# EAGLE board micromouse (EAGLE 9.6.2), part 1 of 2
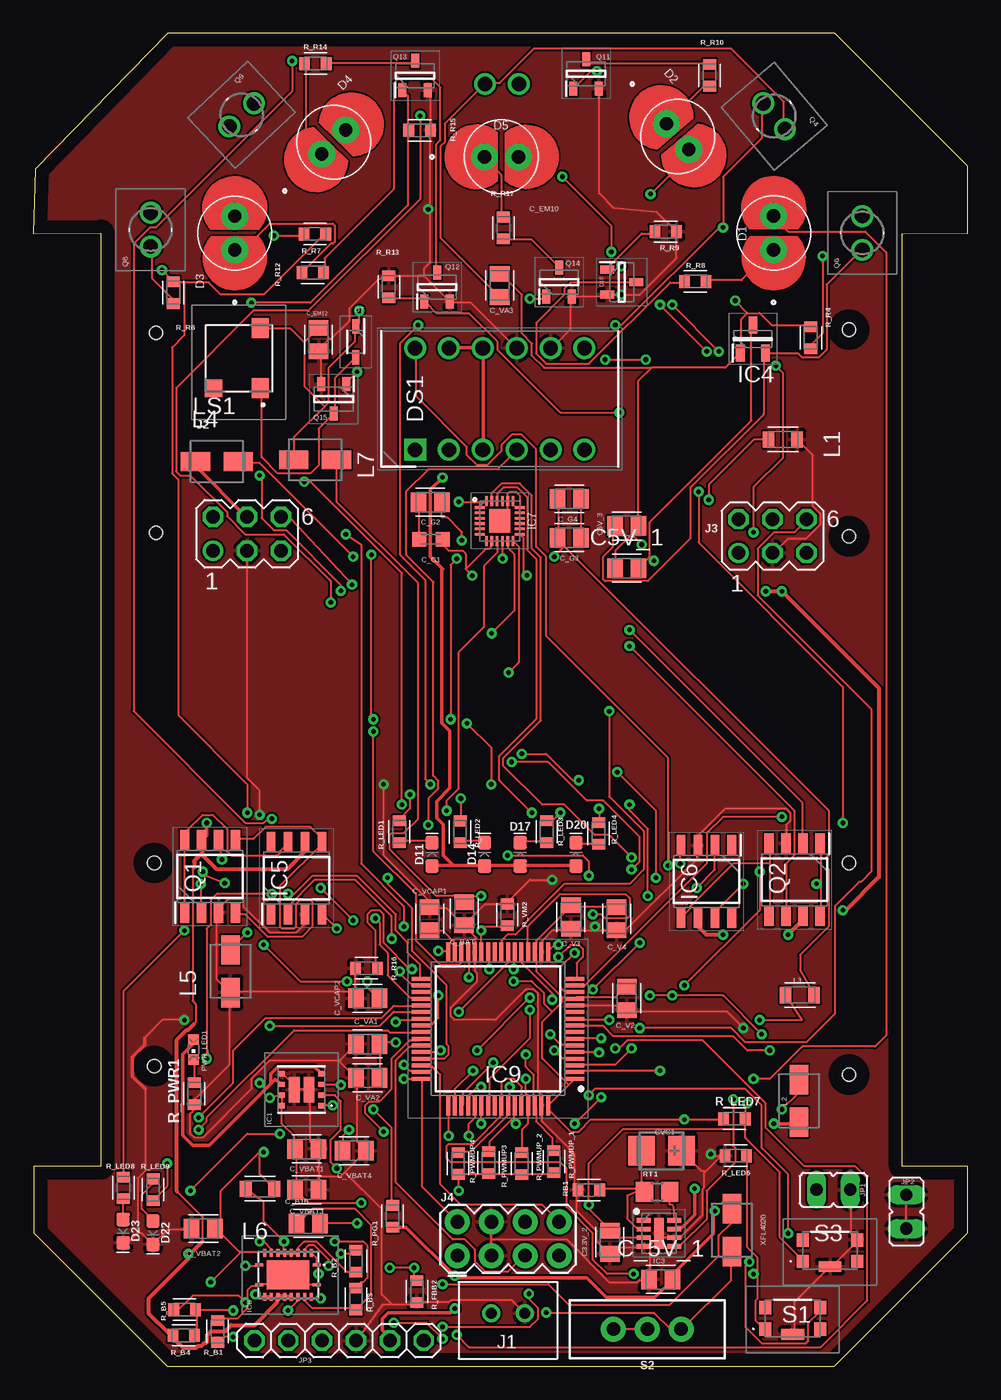
[diagram p2: board, top side]
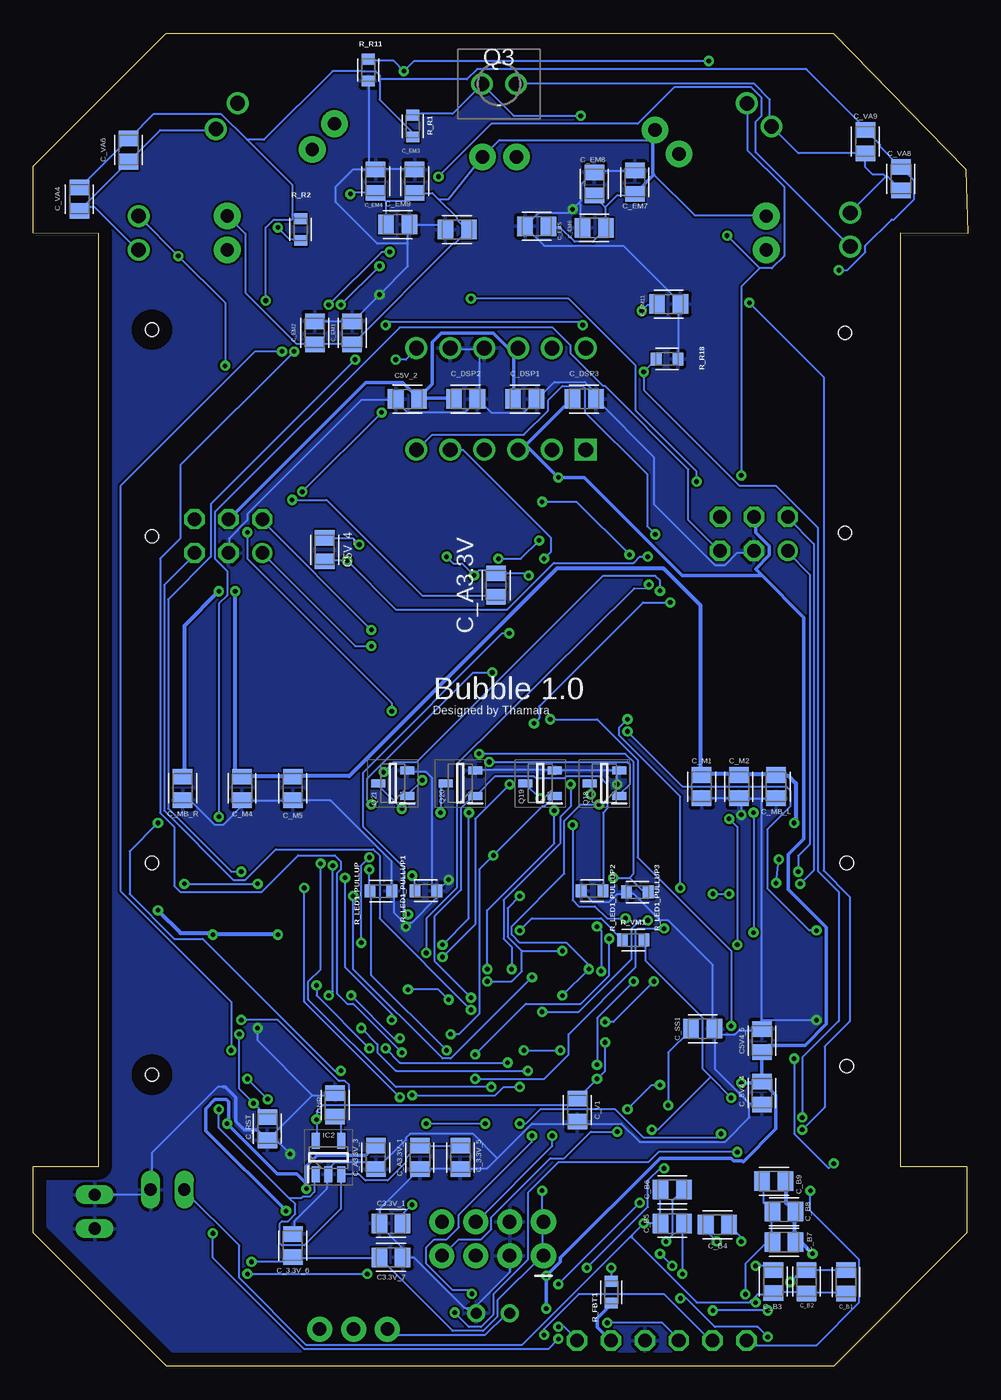
[diagram p3: board, bottom side, seen from below]

Size 70.05 x 99.97 mm. Coordinates in mm from the lower left corner, seen from the top.
Outline: 0.05,15 0.05,10 10.05,0 60.05,0 70.05,10 70.05,15 65.16,15 65.16,84.95 70.05,85 70.05,90 60.07,99.97 10.07,99.97 0.13,89.8 0,84.93 5.06,84.99 5.06,15 0.05,15
Copper layers (1*16): Top 0.035mm / dielectric 1.5mm / Bottom 0.035mm
Design rules "default *": minimum track width 6mil, minimum drill 0.35mm, track to track 6mil, track to pad 6mil, pad to pad 6mil, via to via 6mil, smd to smd 6mil, copper to edge 40mil, drill to drill 6mil, minimum pad ring 10mil, minimum via ring 8mil, stop-mask expansion 4mil, vias tented up to drill 0mil, thermal gap 10mil
Holes 1 mm at 9.19,62.51 9.19,77.49 61.16,77.75 61.16,62.25 61.16,37.75 61.16,21.87 9.06,22.51 9.06,37.75
vRestrict: area 5.1,42 to 25.1,58; area 45.2,41.6 to 65.2,57.6; area 61.1,57.7 to 65.1,81.7; area 5.1,16 to 9.1,42; area 5.2,58 to 9.2,82; area 61.2,15.6 to 65.2,41.6; 6 lines

## Footprints (pad centres in the part's own frame; a part is rotated, then mirrored left to right if it is on the bottom)
CAPC2012X110 = smd 1.165 x 1.465: 1 -0.875,0; 2 0.875,0
C0603K = smd 1.05 x 1.08: 1 -0.875,0; 2 0.875,0
CT3528 = smd 2 x 2.2: + -1.5,0; - 1.5,0
DIO_SFH_4545 = drill 1 pad 2: A 1.27,0; C -1.27,0
SOD2513X120N = smd 1.075 x 0.5: 1 -1.162,0; 2 1.162,0
LED-0603 = smd 1 x 1: A -0.877,0; C 0.877,0
DIPS762W64P254L1778H508Q12N = drill 1.1 pad 1.65 square: 1 0,0 | drill 1.1 pad 1.65: 2 0,-2.54; 3 0,-5.08; 4 0,-7.62; 5 0,-10.16; 6 0,-12.7; 7 7.62,-12.7; 8 7.62,-10.16; 9 7.62,-7.62; 10 7.62,-5.08; 11 7.62,-2.54; 12 7.62,0
LMZ21701SILT = smd 0.45 x 0.4: 1 -1.475,1.2; 2 -1.475,0.4; 3 -1.475,-0.4; 4 -1.475,-1.2; 5 1.475,-1.2; 6 1.475,-0.4; 7 1.475,0.4; 8 1.475,1.2 | smd 0.8 x 1.9: 9 0.55,0; 10 -0.55,0
SOT95P280X145-5N = smd 1.2 x 0.6: 1 -1.25,0.95; 2 -1.25,0; 3 -1.25,-0.95; 4 1.25,-0.95; 5 1.25,0.95
SON65P260X300X150-9N = smd 1.05 x 0.35: 1 -1.15,0.975; 2 -1.15,0.325; 3 -1.15,-0.325; 4 -1.15,-0.975; 5 1.15,-0.975; 6 1.15,-0.325; 7 1.15,0.325; 8 1.15,0.975 | smd 0.7 x 2.35: 9 0,0
SOT95P237X112-3N = smd 1.25 x 0.65: 1 -1.05,0.95; 2 -1.05,-0.95; 3 1.05,0
SOIC127P600X175-8N = smd 1.528 x 0.65: 1 -2.711,1.905; 2 -2.711,0.635; 3 -2.711,-0.635; 4 -2.711,-1.905; 5 2.711,-1.905; 6 2.711,-0.635; 7 2.711,0.635; 8 2.711,1.905
QFN40P300X300X95-25N = smd 0.75 x 0.2: 1 -1.5,1; 2 -1.5,0.6; 3 -1.5,0.2; 4 -1.5,-0.2; 5 -1.5,-0.6; 6 -1.5,-1; 13 1.5,-1; 14 1.5,-0.6; 15 1.5,-0.2; 16 1.5,0.2; 17 1.5,0.6; 18 1.5,1 | smd 0.2 x 0.75: 7 -1,-1.5; 8 -0.6,-1.5; 9 -0.2,-1.5; 10 0.2,-1.5; 11 0.6,-1.5; 12 1,-1.5; 19 1,1.5; 20 0.6,1.5; 21 0.2,1.5; 22 -0.2,1.5; 23 -0.6,1.5; 24 -1,1.5 | smd 1.59 x 1.75: 25 0,0
BQ24031IRHLRQ1 = smd 0.24 x 0.6: 1 -0.75,2.15; 10 -0.75,-2.15; 11 0.75,-2.15; 20 0.75,2.15 | smd 0.6 x 0.24: 2 -1.65,1.75; 3 -1.65,1.25; 4 -1.65,0.75; 5 -1.65,0.25; 6 -1.65,-0.25; 7 -1.65,-0.75; 8 -1.65,-1.25; 9 -1.65,-1.75; 12 1.65,-1.75; 13 1.65,-1.25; 14 1.65,-0.75; 15 1.65,-0.25; 16 1.65,0.25; 17 1.65,0.75; 18 1.65,1.25; 19 1.65,1.75 | smd 2.19 x 3.19: 21 0,0
QFP50P1200X1200X160-64N = smd 1.45 x 0.3: 1 -5.75,3.75; 2 -5.75,3.25; 3 -5.75,2.75; 4 -5.75,2.25; 5 -5.75,1.75; 6 -5.75,1.25; 7 -5.75,0.75; 8 -5.75,0.25; 9 -5.75,-0.25; 10 -5.75,-0.75; 11 -5.75,-1.25; 12 -5.75,-1.75; 13 -5.75,-2.25; 14 -5.75,-2.75; 15 -5.75,-3.25; 16 -5.75,-3.75; 33 5.75,-3.75; 34 5.75,-3.25; 35 5.75,-2.75; 36 5.75,-2.25; 37 5.75,-1.75; 38 5.75,-1.25; 39 5.75,-0.75; 40 5.75,-0.25; 41 5.75,0.25; 42 5.75,0.75; 43 5.75,1.25; 44 5.75,1.75; 45 5.75,2.25; 46 5.75,2.75; 47 5.75,3.25; 48 5.75,3.75 | smd 0.3 x 1.45: 17 -3.75,-5.75; 18 -3.25,-5.75; 19 -2.75,-5.75; 20 -2.25,-5.75; 21 -1.75,-5.75; 22 -1.25,-5.75; 23 -0.75,-5.75; 24 -0.25,-5.75; 25 0.25,-5.75; 26 0.75,-5.75; 27 1.25,-5.75; 28 1.75,-5.75; 29 2.25,-5.75; 30 2.75,-5.75; 31 3.25,-5.75; 32 3.75,-5.75; 49 3.75,5.75; 50 3.25,5.75; 51 2.75,5.75; 52 2.25,5.75; 53 1.75,5.75; 54 1.25,5.75; 55 0.75,5.75; 56 0.25,5.75; 57 -0.25,5.75; 58 -0.75,5.75; 59 -1.25,5.75; 60 -1.75,5.75; 61 -2.25,5.75; 62 -2.75,5.75; 63 -3.25,5.75; 64 -3.75,5.75
B2B-XH-A = drill 0.84: 1 0,0; 2 2.5,0
MA03-2 = drill 1.016: 1 -2.54,-1.27 | drill 1.016 octagon: 2 -2.54,1.27; 3 0,-1.27; 4 0,1.27; 5 2.54,-1.27; 6 2.54,1.27
2X4 = drill 1.016 pad 1.88: 1 -3.81,-1.27; 2 -3.81,1.27; 3 -1.27,-1.27; 4 -1.27,1.27; 5 1.27,-1.27; 6 1.27,1.27; 7 3.81,-1.27; 8 3.81,1.27
JP1 = drill 0.914 long: 1 0,-1.27; 2 0,1.27
1X06 = drill 1.016 octagon: 1 -6.35,0; 2 -3.81,0; 3 -1.27,0; 4 1.27,0; 5 3.81,0; 6 6.35,0
INDC2009X120 = smd 0.876 x 1.21: 1 -1.067,0; 2 1.067,0
L4035M = smd 2.2 x 1.4: 1 -1.6,0; 2 1.6,0
SMT0540SR = smd 1.5 x 1.3: 1 -2.25,-1.6; 2 2.25,-1.6 | smd 1.3 x 1.3: 3 -2.25,1.9
CHIPLED_0603 = smd 0.8 x 0.8: A 0,-0.75; C 0,0.75
SOIC127P600X175-8N' = smd 1.525 x 0.7: 1 -2.712,1.905; 2 -2.712,0.635; 3 -2.712,-0.635; 4 -2.712,-1.905; 5 2.712,-1.905; 6 2.712,-0.635; 7 2.712,0.635; 8 2.712,1.905
TEFT4300 = drill 1.09 pad 1.635: 1 -1.27,0; 2 1.27,0
SOT95P240X88-3N = smd 1.05 x 0.6: 1 -1.1,0.95; 2 -1.1,-0.95; 3 1.1,0
RESC1608X60 = smd 0.799 x 0.974: 1 -0.815,0; 2 0.815,0
R0805 = smd 1.3 x 1.5: 1 -0.95,0; 2 0.95,0
KMR211G = smd 0.9 x 1: 1 2.05,0.8; 2 2.05,-0.8; 3 -2.05,0.8; 4 -2.05,-0.8 | smd 1.7 x 0.8: 5 0,1.2
SWITCH_SPDT_PTH_11.6X4.0MM = drill 1.016 pad 1.88: 1 0,2.54; 2 0,0; 3 0,-2.54

## Placement (x,y rotation side)
C3.3V_1  0.1uf  [CAPC2012X110]  43.23,10.7 0 bottom
C3.3V_2  47uf  [CAPC2012X110]  43.23,9.3 90 top
C3.3V_7  10uf  [CAPC2012X110]  43.23,8.16 180 bottom
C5V4_5  47uF  [CAPC2012X110]  15.41,24.42 90 bottom
C5V_1  0.1uf  [CAPC2012X110]  44.5,59.85 0 top
C5V_2  0.1uf  [CAPC2012X110]  42,72.54 0 bottom
C5V_3  0.1uf  [CAPC2012X110]  44.5,63.02 0 top
C5V_4  0.1uf  [CAPC2012X110]  48.2,61.24 270 bottom
C_3.3V_5  10uf  [CAPC2012X110]  38.02,15.65 90 bottom
C_3.3V_6  0.1uf  [CAPC2012X110]  50.59,9.05 270 bottom
C_5V4_4  0.1uF  [CAPC2012X110]  15.41,20.48 90 bottom
C_5V_1  100uf  [CAPC2012X110]  47.04,6.51 0 top
C_A3.3V  2.2uf  [CAPC2012X110]  35.35,58.58 90 bottom
C_A3.3V_1  0.1uf  [CAPC2012X110]  41.07,15.65 90 bottom
C_A3.3V_3  0.1uf  [CAPC2012X110]  44.37,15.65 90 bottom
C_B1  47uf  [CAPC2012X110]  9.12,6.32 270 bottom
C_B2  0.1uf  [CAPC2012X110]  12.07,6.34 270 bottom
C_B3  0.1uf  [CAPC2012X110]  14.57,6.35 90 bottom
C_B4  0.1uf  [CAPC2012X110]  18.75,10.61 0 bottom
C_B5  2.2uf  [CAPC2012X110]  22.14,10.7 0 bottom
C_B6  470 pf  [CAPC2012X110]  22.14,13.24 0 bottom
C_B7  0.1uf  [CAPC2012X110]  13.76,9.3 180 bottom
C_B8  47uf  [CAPC2012X110]  13.76,11.59 180 bottom
C_B9  47uf  [CAPC2012X110]  14.52,13.88 180 bottom
C_B10  22 pf  [CAPC2012X110]  20.62,10.7 180 top
C_BAT  2.2uF  [CAPC2012X110]  32.3,33.94 270 top
C_DSP1  10uf  [CAPC2012X110]  33.19,72.55 0 bottom
C_DSP2  0.1uf  [CAPC2012X110]  37.64,72.55 0 bottom
C_DSP3  10uf  [CAPC2012X110]  28.75,72.55 0 bottom
C_EM1  4.7uF  [CAPC2012X110]  46.15,77.5 90 bottom
C_EM2  0.1uF  [CAPC2012X110]  48.94,77.5 90 bottom
C_EM3  0.1uF  [CAPC2012X110]  41.46,88.89 90 bottom
C_EM4  4.7uF  [CAPC2012X110]  44.38,88.89 90 bottom
C_EM5  0.1uF  [CAPC2012X110]  32.3,85.5 180 bottom
C_EM6  4.7uF  [CAPC2012X110]  27.99,85.38 180 bottom
C_EM7  0.1uF  [CAPC2012X110]  24.94,88.81 90 bottom
C_EM8  4.7uF  [CAPC2012X110]  27.99,88.68 90 bottom
C_EM9  4.7uF  [CAPC2012X110]  42.72,85.63 0 bottom
C_EM10  0.1uF  [CAPC2012X110]  38.27,85.25 180 bottom
C_EM11  10uF  [CAPC2012X110]  22.4,79.66 0 bottom
C_EM12  0.1uF  [CAPC2012X110]  21.38,77 90 top
C_G1  0.01uF  [C0603K]  29.81,62.02 0 top
C_G2  0.1uF  [CAPC2012X110]  29.76,64.8 180 top
C_G3  0.1uF  [CAPC2012X110]  40.18,62.14 0 top
C_G4  2.2uF  [CAPC2012X110]  40.18,65.06 0 top
C_M1  0.1uF  [CAPC2012X110]  19.94,43.47 270 bottom
C_M2  4.7uF  [CAPC2012X110]  17.14,43.47 90 bottom
C_M4  4.7uF  [CAPC2012X110]  54.4,43.34 90 bottom
C_M5  0.1uF  [CAPC2012X110]  50.59,43.34 270 bottom
C_MB_L  100uF  [CAPC2012X110]  14.35,43.47 90 bottom
C_MB_R  100uF  [CAPC2012X110]  58.85,43.34 90 bottom
C_RST  0.1uF  [CAPC2012X110]  52.5,17.81 270 bottom
C_SS1  3300pF  [CAPC2012X110]  19.86,25.31 180 bottom
C_V1  0.1uF  [CAPC2012X110]  29.26,19.21 90 bottom
C_V2  0.1uF  [CAPC2012X110]  44.5,27.59 270 top
C_V3  0.1uF  [CAPC2012X110]  40.31,33.69 270 top
C_V4  0.1uF  [CAPC2012X110]  43.73,33.56 270 top
C_VA1  2.2uF  [CAPC2012X110]  25.07,24.16 180 top
C_VA2  0.1uF  [CAPC2012X110]  25.07,21.62 180 top
C_VA3  2.2uF  [CAPC2012X110]  34.97,81.06 90 top
C_VA4  2.2uF  [CAPC2012X110]  66.59,87.54 90 bottom
C_VA6  2.2uF  [CAPC2012X110]  62.91,91.22 90 bottom
C_VA8  2.2uF  [CAPC2012X110]  5,89.06 90 bottom
C_VA9  2.2uF  [CAPC2012X110]  7.67,91.85 90 bottom
C_VBAT1  0.1uf  [CAPC2012X110]  20.49,16.29 0 top
C_VBAT2  0.1uf  [CAPC2012X110]  12.75,10.32 180 top
C_VBAT3  0.1uf  [CAPC2012X110]  20.49,13.24 180 top
C_VBAT4  47uf  [CAPC2012X110]  24.05,16.16 180 top
C_VCAP1  2.2uF  [CAPC2012X110]  29.71,33.56 270 top
C_VCAP2  2.2uF  [CAPC2012X110]  25.07,27.59 180 top
CNR  0.1uf  [CAPC2012X110]  47.42,19.59 270 bottom
CVC1  470uf  [CT3528]  47.09,16.16 180 top
D1  SFH_4545  [DIO_SFH_4545]  55.51,85 90 top
D2  SFH_4545  [DIO_SFH_4545]  48.31,92.23 310.8 top
D3  SFH_4545  [DIO_SFH_4545]  15.1,84.99 90 top
D4  SFH_4545  [DIO_SFH_4545]  22.53,91.82 45 top
D5  SFH_4545  [DIO_SFH_4545]  35.1,90.71 0 top
D7  1N4148WSQ-13-F  [SOD2513X120N]  24.18,76.82 270 top
D11  [LED-0603]  29.89,38.39 90 top
D14  [LED-0603]  33.83,38.39 90 top
D17  [LED-0603]  36.5,38.39 90 top
D20  [LED-0603]  40.69,38.39 90 top
D22  [LED-0603]  8.97,10.01 270 top
D23  [LED-0603]  6.73,10.13 270 top
DS1  HCMS-2903  [DIPS762W64P254L1778H508Q12N]  28.62,68.74 90 top
IC1  LMZ21701SILT  [LMZ21701SILT]  20.11,20.73 180 top
IC2  TPS73633MDBVREPG4  [SOT95P280X145-5N]  47.92,15.65 90 bottom
IC3  LMZ10501SILR  [SON65P260X300X150-9N]  46.91,9.97 0 top
IC4  MCP1700T-5002E_TT  [SOT95P237X112-3N]  53.95,77.04 90 top
IC5  UCC27524DR  [SOIC127P600X175-8N]  19.73,36.61 90 top
IC6  UCC27524DR  [SOIC127P600X175-8N]  50.47,36.36 270 top
IC7  MPU-6500  [QFN40P300X300X95-25N]  34.97,63.41 0 top
IC8  TPS61088RHLT  [BQ24031IRHLRQ1]  19.1,6.84 270 top
IC9  STM32F405RGT6V  [QFP50P1200X1200X160-64N]  34.84,25.31 180 top
J1  3A/250V  [B2B-XH-A]  34.34,3.97 0 top
J2  [MA03-2]  16.02,62.43 0 top
J3  [MA03-2]  55.42,62.26 0 top
J4  [2X4]  35.61,9.56 0 top
JP1  [JP1]  59.99,13.24 90 top
JP2  [JP1]  65.45,11.59 0 top
JP3  [1X06]  22.92,1.92 180 top
L1  10 uH  [INDC2009X120]  56.2,69.51 180 top
L2  4.7 uH  [L4035M]  57.41,19.91 90 top
L3  10uH  [INDC2009X120]  57.47,27.83 0 top
L4  4.7 uH  [L4035M]  13.76,67.85 0 top
L5  4.7 uH  [L4035M]  14.78,29.62 90 top
L6  2.2 uH  [INDC2009X120]  17,13.31 180 top
L7  4.7 uH  [L4035M]  21.13,67.98 0 top
LS1  SMT-0540-S-R  [SMT0540SR]  15.41,75.6 90 top
PWR_LED1  GREEN  [CHIPLED_0603]  12.02,23.75 180 top
Q1  ZXMHC3F381N8TC  [SOIC127P600X175-8N']  13.25,36.74 90 top
Q2  ZXMHC3F381N8TC  [SOIC127P600X175-8N']  57.07,36.48 270 top
Q3  TEFT4300  [TEFT4300]  35.13,96.17 0 bottom
Q4  TEFT4300  [TEFT4300]  55.55,93.76 310.1 top
Q6  TEFT4300  [TEFT4300]  62.15,85 270 top
Q8  TEFT4300  [TEFT4300]  8.8,85.25 90 top
Q9  TEFT4300  [TEFT4300]  15.62,93.85 223.2 top
Q10  SSM3K324R  [SOT95P240X88-3N]  44.12,81.31 0 top
Q11  SSM3K324R  [SOT95P240X88-3N]  41.45,96.93 90 top
Q12  SSM3K324R  [SOT95P240X88-3N]  30.27,80.93 90 top
Q13  SSM3K324R  [SOT95P240X88-3N]  28.62,96.81 90 top
Q14  SSM3K324R  [SOT95P240X88-3N]  39.42,81.31 90 top
Q15  SSM3K324R  [SOT95P240X88-3N]  22.53,72.55 270 top
Q18  SSM3K324R  [SOT95P240X88-3N]  27.22,43.72 180 bottom
Q19  SSM3K324R  [SOT95P240X88-3N]  32.05,43.72 180 bottom
Q20  SSM3K324R  [SOT95P240X88-3N]  38.02,43.72 180 bottom
Q21  SSM3K324R  [SOT95P240X88-3N]  43.1,43.72 180 bottom
R_B1  100K  [RESC1608X60]  13.82,2.61 270 top
R_B2  150K  [RESC1608X60]  24.18,7.88 90 top
R_B3  35.7K  [RESC1608X60]  24.19,5.04 270 top
R_B4  94.65K  [RESC1608X60]  11.28,2.32 180 top
R_B5  10K  [RESC1608X60]  11.34,4.24 0 top
R_FBB2  10k  [RESC1608X60]  28.76,5.6 90 top
R_FBT1  52.5K  [RESC1608X60]  26.72,5.55 270 bottom
R_LED1  330 ohm  [RESC1608X60]  27.43,40.09 270 top
R_LED1_PULLUP  10k  [RESC1608X60]  43.99,35.63 180 bottom
R_LED1_PULLUP1  10k  [RESC1608X60]  40.62,35.65 180 bottom
R_LED1_PULLUP2  10k  [RESC1608X60]  28.15,35.66 0 bottom
R_LED1_PULLUP3  10k  [RESC1608X60]  24.75,35.56 0 bottom
R_LED2  330 ohm  [RESC1608X60]  32,40.07 270 top
R_LED3  330 ohm  [RESC1608X60]  38.49,40.09 270 top
R_LED4  330 ohm  [RESC1608X60]  42.38,39.96 270 top
R_LED6  47K  [RESC1608X60]  52.67,15.79 180 top
R_LED7  330 ohm  [RESC1608X60]  52.57,18.56 0 top
R_LED8  1K  [RESC1608X60]  6.75,13.38 270 top
R_LED9  1K  [RESC1608X60]  8.98,13.23 270 top
R_PG1  10K  [RESC1608X60]  26.93,11.25 90 top
R_PWMUP3  10k  [RESC1608X60]  34.13,15.27 270 top
R_PWMUP4  10k  [RESC1608X60]  31.84,15.2 270 top
R_PWMUP_1  10k  [RESC1608X60]  39.04,15.35 270 top
R_PWMUP_2  10k  [RESC1608X60]  36.62,15.19 270 top
R_PWR1  1K  [RESC1608X60]  12.06,20.45 90 top
R_R1  4.7k  [RESC1608X60]  41.6,93.01 90 bottom
R_R2  1.8k  [RESC1608X60]  50,85.26 270 bottom
R_R4  1.8k  [RESC1608X60]  58.3,77.13 270 top
R_R6  1.8k  [RESC1608X60]  10.49,80.52 270 top
R_R7  1.8k  [RESC1608X60]  21.11,84.92 180 top
R_R8  0.75 ohm  [RESC1608X60]  49.63,81.36 0 top
R_R9  10k  [RESC1608X60]  47.42,85.09 180 top
R_R10  0.75 ohm  [RESC1608X60]  50.71,96.82 270 top
R_R11  10k  [RESC1608X60]  44.93,97.21 90 bottom
R_R12  0.75 ohm  [RESC1608X60]  20.95,82.02 180 top
R_R13  10k  [RESC1608X60]  26.65,80.95 270 top
R_R14  0.75 ohm  [RESC1608X60]  21.15,97.71 180 top
R_R15  10k  [RESC1608X60]  28.97,92.7 180 top
R_R16  10k  [RESC1608X60]  24.98,29.85 0 top
R_R17  0.75 ohm  [RESC1608X60]  35.24,85.37 90 top
R_R18  10k  [RESC1608X60]  22.53,75.55 180 bottom
R_VM1  4.7k  [RESC1608X60]  25.06,31.96 0 bottom
R_VM2  10k  [RESC1608X60]  35.53,33.85 270 top
RB1  115K  [RESC1608X60]  41.65,13.21 0 top
RT1  223K  [R0805]  46.76,13.08 0 top
S1  KMR211G  [KMR211G]  56.94,3.59 180 top
S2  [SWITCH_SPDT_PTH_11.6X4.0MM]  46.04,2.78 90 top
S3  KMR211G  [KMR211G]  59.74,8.67 180 top
XFL4020  4.7 uH  [L4035M]  52.37,10.21 270 top